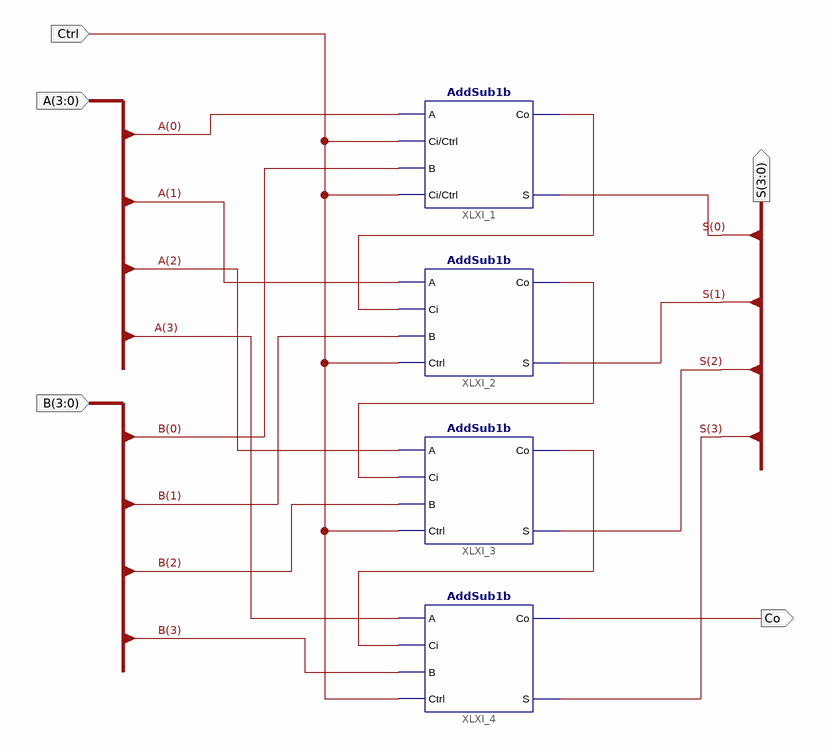
[diagram p0: schematic sheet 1]
// Xilinx ISE schematic AddSub4b.sch (kintex7) as structural Verilog: 4 symbols, 5 ports
module AddSub4b (
  input  [3:0] A,
  input  [3:0] B,
  input  Ctrl,
  output Co,
  output [3:0] S
);

  wire XLXN_1, XLXN_2, XLXN_3;

  AddSub1b XLXI_1 (.A(A[0]), .Ci(Ctrl), .B(B[0]), .Ctrl(Ctrl), .Co(XLXN_1), .S(S[0]));
  AddSub1b XLXI_2 (.A(A[1]), .Ci(XLXN_1), .B(B[1]), .Ctrl(Ctrl), .Co(XLXN_2), .S(S[1]));
  AddSub1b XLXI_3 (.A(A[2]), .Ci(XLXN_2), .B(B[2]), .Ctrl(Ctrl), .Co(XLXN_3), .S(S[2]));
  AddSub1b XLXI_4 (.A(A[3]), .Ci(XLXN_3), .B(B[3]), .Ctrl(Ctrl), .Co(Co), .S(S[3]));
endmodule
